# Altium schematic sheet Sheet-QBOOST-v0.2.SchDoc
size A1; Organization: Protel International P/L; Address1: L3, 12a Rodborough Rd; Address2: Frenchs Forest; Address3: NSW; Address4: Australia 2086
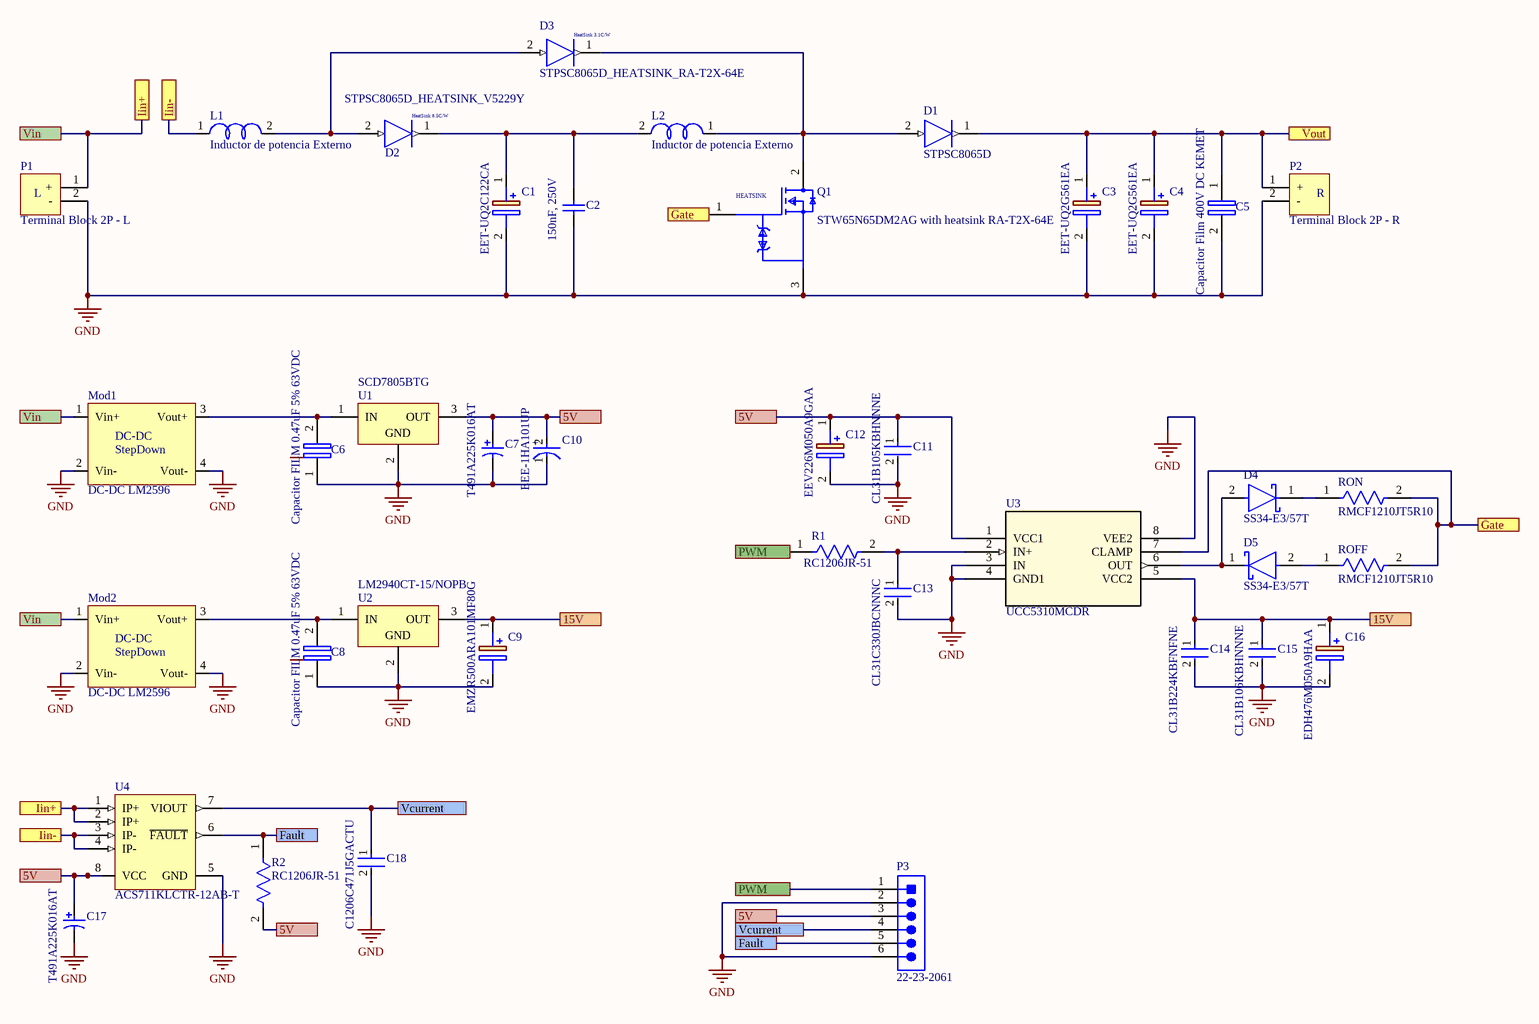
[diagram p0: Sheet-QBOOST-v0.2.SchDoc]

## Parts
C1  EET-UQ2C122CA  [CAPPRD1000W200D2550H3700]
C2  150nF, 250V  [WCAP-FTBP_L10.5W5H11]
C3  EET-UQ2G561EA  [CAPPRD1000W200D3550H3700]
C4  EET-UQ2G561EA  [CAPPRD1000W200D3550H3700]
C5  Capacitor Film 400V DC KEMET  [Cap Film 18x5]
C6  Capacitor FILM 0.47uF 5% 63VDC  [Capacitor 5mm Radial]
C7  T491A225K016AT  [KEMT-T491-A_N]
C8  Capacitor FILM 0.47uF 5% 63VDC  [Capacitor 5mm Radial]
C9  EMZR500ARA101MF80G  [CAP6.3X8]
C10  EEE-1HA101UP  [FP-SF-MFG]
C11  CL31B105KBHNNNE  [FP-CL31-IPC_B]
C12  EEV226M050A9GAA  [CAP6.3X5.65]
C13  CL31C330JBCNNNC  [FP-CL31-IPC_B]
C14  CL31B224KBFNFNE  [FP-CL31-IPC_B]
C15  CL31B106KBHNNNE  [FP-CL31-IPC_B]
C16  EDH476M050A9HAA  [CAP6.3X8]
C17  T491A225K016AT  [KEMT-T491-A_N]
C18  C1206C471J5GACTU  [FP-C1206C-EB-IPC_B]
D1  STPSC8065D  [TO505P460X1020X1968-2P]
D2  STPSC8065D_HEATSINK_V5229Y  [TO505P460X1020X1968-2P - HEATSINK - V5229Y]
D3  STPSC8065D_HEATSINK_RA-T2X-64E  [TO505P460X1020X1968-2P - HEATSINK - RA-T2X-64E]
D4  SS34-E3/57T  [FP-95402-MFG]
D5  SS34-E3/57T  [FP-95402-MFG]
L1  Inductor de potencia Externo  [KF7.62-P3]
L2  Inductor de potencia Externo  [KF7.62-P3]
Mod1  DC-DC LM2596  [Mod 21x43 mm]
Mod2  DC-DC LM2596  [Mod 21x43 mm]
P1  Terminal Block 2P - L  [KF7.62-P2 - TB - L]
P2  Terminal Block 2P - R  [KF7.62-P2 - TB - R]
P3  22-23-2061  [MOLX-22-23-2061_V]
Q1  STW65N65DM2AG with heatsink RA-T2X-64E  [FP-TO-247-0075325-MFG HEATSINK RA-T2X-64E]
R1  RC1206JR-51  [FP-RC1206-IPC_B]
R2  RC1206JR-51  [FP-RC1206-IPC_B]
ROFF  RMCF1210JT5R10  [FP-RC3225-IPC_B]
RON  RMCF1210JT5R10  [FP-RC3225-IPC_B]
U1  SCD7805BTG  [T0220-3]
U2  LM2940CT-15/NOPB  [T0220-3]
U3  UCC5310MCDR  [D8_TEX]
U4  ACS711KLCTR-12AB-T  [ALEG-LC-SOIC-8_V]

## Ports
5V, 15V, Fault, Gate, Iin+, Iin-, PWM, Vcurrent, Vin, Vout

## Nets
GND: C1.2(-) C2.1 C3.2(-) C4.2(-) C5.2 C6.1 C7.2 C8.1 C9.2(-) C10.1(C) C11.2 C12.2(-) C13.2 C14.2 C15.2 C16.2(-) C17.2 C18.2 Mod1.2(Vin-) Mod1.4(Vout-) Mod2.2(Vin-) Mod2.4(Vout-) P1.2(-) P2.2(-) P3.2 P3.6 Q1.3(S) U1.2(GND) U2.2(GND) U3.3(IN) U3.4(GND1) U3.8(VEE2) U4.5(GND)
5V: C7.1 C10.2(A) C11.1 C12.1(+) C17.1 P3.3 R2.2 U1.3(OUT) U3.1(VCC1) U4.8(VCC) ; port 5V
15V: C9.1(+) C14.1 C15.1 C16.1(+) U2.3(OUT) U3.5(VCC2) ; port 15V
Fault: P3.5 R2.1 U4.6(~{FAULT}) ; port Fault
Gate: Q1.1(G) ROFF.2 RON.2 U3.7(CLAMP) ; port Gate
Iin+: Mod1.1(Vin+) Mod2.1(Vin+) P1.1(+) U4.1(IP+) U4.2(IP+) ; port Iin+, port Vin
Iin-: L1.1 U4.3(IP-) U4.4(IP-) ; port Iin-
PWM: P3.1 R1.1 ; port PWM
Vcurrent: C18.1 P3.4 U4.7(VIOUT) ; port Vcurrent
Vout: C3.1(+) C4.1(+) C5.1 D1.1(K) P2.1(+) ; port Vout
NetC1_1: C1.1(+) C2.2 D2.1(K) L2.2
NetC6_2: C6.2 Mod1.3(Vout+) U1.1(IN)
NetC8_2: C8.2 Mod2.3(Vout+) U2.1(IN)
NetC13_1: C13.1 R1.2 U3.2(IN+)
NetD1_2: D1.2(A) D3.1(K) L2.1 Q1.2(D)
NetD2_2: D2.2(A) D3.2(A) L1.2
NetD4_1: D4.1(C) RON.1
NetD4_2: D4.2(A) D5.1(C) U3.6(OUT)
NetD5_2: D5.2(A) ROFF.1

## Notes on the sheet
- Title
- Size:
- Date:
- File:
- A1
- Number:
- Time:
- Revision:
- Sheet
- of
- (in symbol CMP-05427-000015-1) +
- (in symbol DC-DC LM2596) DC-DC; StepDown
- (in symbol MOSFET N STW65N65DM2AG_HEATSINK) HEATSINK
- (in symbol STPSC8065D_HEATSINK_RA-T2X-64E) HeatSink 3.1C/W
- (in symbol STPSC8065D_HEATSINK_V5229Y) HeatSink 8.5C/W
- (in symbol Terminal Block 2P - L) L
- (in symbol Terminal Block 2P - R) R

## Library data of the parts
C1 = EET-UQ2C122CA: Capacitor Polarised; Manufacturer_Name: Panasonic; Datasheet Link: https://media.digikey.com/pdf/Data%20Sheets/Panasonic%20Capacitors%20PDFs/TS-UQ_Series_2007.pdf; Height: 37mm; Manufacturer_Part_Number: EET-UQ2C122CA; Arrow Part Number: EET-UQ2C122CA
C2 = 890273322005CS: WCAP-FTBP Film Capacitor, THT, L10.5W5H11, 150nF, 250V; Manufacturer: Wurth Elektronik; Insulation Resistance: 30000MOhm; Dissipation Factor@1kHz: 0.1%; Dissipation Factor@100kHz: 0.26%; Rated Voltage: 250VDC; Rate of Voltage Rise: 340V/us; Pitch: 7.5mm; Technical Reference: MPPP075154J250DCPP45004; Capacitance Tolerance: +/-5%; ComponentLink1Description: Manufacturer; ComponentLink1URL: http://www.we-online.de; ComponentLink2Description: Datasheet; ComponentLink2URL: https://www.we-online.com/catalog/datasheet/890273322005CS.pdf; Length: 10.5mm; Mounting Technology: THT; Operating Temperature: -40 to +105degC; Manufacturer Part Number: 890273322005CS; Width: 5mm; Capacitance: 150nF; Dissipation Factor@10kHz: 0.1%; Height: 11mm; Packaging: Carton; Published Date: May 2020
C3 C4 = EET-UQ2G561EA: Capacitor Polarised; Manufacturer_Name: Panasonic; Datasheet Link: https://media.digikey.com/pdf/Data%20Sheets/Panasonic%20Capacitors%20PDFs/TS-UQ_Series_2007.pdf; Height: 37mm; Manufacturer_Part_Number: EET-UQ2G561EA; Arrow Part Number: EET-UQ2G561EA
C5 = Cap film 400V DC 0.1uF
C7 C17 = CMP-2000-07187-1: Tantalum Capacitor, 2.2 uF, +/- 10%, 16 V, -55 to 125 degC, 2-Pin SMD, RoHS, Tape and Reel; Manufacturer: Kemet; Capacitance: 2200000pF; Product Depth (mm): 1.6mm; DCL: 0.4uA; Wire Form: NotRequired; Case Style: Molded; ESR: 6ohm; Polarity: Polar; Product Length (mm): 3.2mm; Voltage: 16VDC; Lead Spacing (nom): NotRequiredmm; DF: 6%; Rad Hardened: No; Operating Temp Range: -55Cto125C; Datasheet Version: 10/2016; Packaging: TapeandReel; Mounting Style: SurfaceMount; Manufacturer URL: http://www.kemet.com/; Seal: NotRequired; Product Height (mm): 1.6mm; Construction: SMTChip; Length W/Weld: NotRequiredmm; Package Reference: T491-A; Package Description: 2-Pin Surface Mount Device, Body 3.2 x 1.6 mm; Tolerance (+ or -): 10%; Length W/Weld (max): NotRequiredmm; Insulation: NotRequired; Mounting Technology: SurfaceMount; Package / Case: 3216-18; Seated Plane Height: NotRequiredmm; Case Code: A; Datasheet URL: http://capacitoredge.kemet.com/capedge2/DataSheet/Datasheet-T491A225K016AT.pdf?pn=T491A225K016AT; Product Diameter (mm): NotRequiredmm; Failure Rate: NotRequired
C9 = EMZR500ARA101MF80G: CAP ALUM 100UF 20% 50V SMD; Manufacturer_Name: United Chemi-Con; Datasheet Link: http://www.chemi-con.co.jp/cgi-bin/CAT_DB/SEARCH/cat_db_al.cgi?e=e&j=p&pdfname=mzr; Height: 8.2mm; Manufacturer_Part_Number: EMZR500ARA101MF80G
C10 = CMP-05427-000015-1: CAP ALUM 100UF 20% 50V SMD; Manufacturer: Panasonic; Automotive Grade: Grade 3; Leakage Current: 100uA; Dissipation Factor: 0.12%; Life: 2000Hours; Ripple Current: 200mA; Material: Aluminum; ComponentLink2Description: Datasheet; Category: Cap; Voltage Rating: 50V; Value: 100uF; Octopart: https://octopart.com/eee-1ha101up-panasonic-55396734; Digikey Description: CAP ALUM 100UF 20% 50V SMD; Package: SF; RoHS: TRUE; Height: 10.5mm; ComponentLink2URL: https://industrial.panasonic.com/cdbs/www-data/pdf/RDE0000/ABA0000C1145.pdf; Tolerance: 20%; Mouser Description: Cap Aluminum Lytic 100uF 50V 20% (8 X 10.2mm) SMD 200mA 2000h 85C Automotive T/R; Device Class L2: Capacitors; Temperature Range High: +85°C; Lead Free: Yes; Device Class L3: Aluminum Electrolytic Capacitors; Device Class L1: Passive Components; Manufacturer Part Number: EEE-1HA101UP; Temperature: -40°C to +85°C; Automotive: Yes; Capacitance: 100uF; Voltage: 50V; Temperature Range Low: -40°C
C11 = CMP-13271-001662-1: Cap Ceramic 1uF 50V X7R ±10% SMD 1206 +125°C Embossed T/R; Case Code (Metric): 3216; Packaging: Tape and Reel; Depth: 1.6mm; Max Operating Temperature: 125°C; Length: 3.2mm; Contact Plating: Tin; Voltage Rating (DC): 50V; Radiation Hardening: No; Min Operating Temperature: -55°C; Dielectric: X7R; Voltage: 50V; Lead Free: Lead Free; Capacitance: 1uF; Package Quantity: 1; Material: Ceramic; Thickness: 0.071inch; Width: 0.063inch; Voltage Rating: 50V; Case Code (Imperial): 1206; Mount: Surface Mount; Case/Package: 1206; Tolerance: 10%; Height: 1.6mm
C12 = EEV226M050A9GAA: CAP ALUM SMD 105C 22UF 50VDC; Manufacturer_Name: KEMET; Datasheet Link: https://content.kemet.com/datasheets/KEM_A4002_EEV.pdf; Height: 5.65mm; Manufacturer_Part_Number: EEV226M050A9GAA
C13 = CMP-13271-000198-1: Cap Ceramic 33pF 50V C0G ±5% SMD 1206 +125°C Embossed T/R; Temperature Coefficient: 300ppm/°C; Case Code (Imperial): 1206; Mount: Surface Mount; Length: 3.2mm; Packaging: Tape and Reel; Dielectric: C0G; Material: Ceramic; Voltage Rating (DC): 50V; Tolerance: 5%; Lead Free: Lead Free; Max Operating Temperature: 125°C; Case/Package: 1206; Package Quantity: 1; Case Code (Metric): 3216; Min Operating Temperature: -55°C; Capacitance: 33pF; Width: 0.063inch; Height: 0.85mm; Radiation Hardening: No; Voltage Rating: 50V; Voltage: 50V; Depth: 1.6mm; Thickness: 0.039inch
C14 = CMP-13271-000776-1: Cap Ceramic 220nF 50V X7R ±10% SMD 1206 +125°C Embossed T/R; Length: 0.126inch; Case Code (Imperial): 1206; Package Quantity: 1; Case Code (Metric): 3216; Case/Package: 1206; Radiation Hardening: No; Min Operating Temperature: -55°C; Mount: Surface Mount; Max Operating Temperature: 125°C; Depth: 1.6mm; Tolerance: 10%; Capacitance: 220nF; Thickness: 0.055inch; Height: 1.25mm; Dielectric: X7R; Voltage Rating: 50V; Width: 0.063inch; Packaging: Tape and Reel
C15 = CMP-13271-000776-1: CAP CER 10UF 50V  X7R ±10% SMD 1206 +125°C Embossed T/R; Capacitance: 220nF; Length: 0.126inch; Case Code (Imperial): 1206; Package Quantity: 1; Case Code (Metric): 3216; Case/Package: 1206; Radiation Hardening: No; Min Operating Temperature: -55°C; Mount: Surface Mount; Max Operating Temperature: 125°C; Depth: 1.6mm; Tolerance: 10%; Thickness: 0.055inch; Height: 1.25mm; Dielectric: X7R; Voltage Rating: 50V; Width: 0.063inch; Packaging: Tape and Reel
C16 = EDH476M050A9HAA: CAP ALUM SMD 105C 47UF 50VDC; Manufacturer_Name: KEMET; Datasheet Link: https://content.kemet.com/datasheets/KEM_A4049_EDH.pdf; Height: 8mm; Manufacturer_Part_Number: EDH476M050A9HAA
C18 = CMP-03020-008367-1: 1206 C 470pF Ceramic Multilayer Capacitor; 50 V; +125degC; C0G Dielectric; +/-5%; Manufacturer: KEMET; Tolerance: 0.05; Temperature Coefficient: 15%; Voltage Rating: 50 V; Automotive Grade: Grade 0; Manufacturer Part Number: C1206C471J5GACTU; Value: 470 pF; Automotive: Yes; Temperature Range High: +150°C; ComponentLink2URL: https://content.kemet.com/datasheets/KEM_C1007_X8R_ULTRA_150C_SMD.pdf; Octopart: https://octopart.com/c1206c471j5gactu-kemet-123947; Package: C1206C-EB; Capacitance: 470 pF; Temperature Range Low: -55°C; Material: Ceramic; Device Class L1: Passive Components; Device Class L3: Ceramic Capacitors; Ipc Land Pattern Name: CAPC320160X78; Height: 0.88mm; Category: Cap; Lead Free: Yes; ComponentLink2Description: Datasheet; Temperature: -55°C to +150°C; Mouser Description: 1206 C 470pF Ceramic Multilayer Capacitor; 50 V; +125degC; C0G Dielectric; +/-5%; Device Class L2: Capacitors; RoHS: TRUE; Digikey Description: 1206 C 470pF Ceramic Multilayer Capacitor; 50 V; +125degC; C0G Dielectric; +/-5%; Temperature Characteristic: C0G
D1 = STPSC8065D: Diode; Manufacturer_Name: STMicroelectronics; Datasheet Link: http://www.mouser.com/datasheet/2/389/stpsc8065-1156476.pdf; Height: 4.6mm; Manufacturer_Part_Number: STPSC8065D; Arrow Part Number: STPSC8065D
D2 = STPSC8065D_HEATSINK_V5229Y: Diode with heatsink V5229Y; Manufacturer_Name: STMicroelectronics; Datasheet Link: http://www.mouser.com/datasheet/2/389/stpsc8065-1156476.pdf; Height: 4.6mm; Manufacturer_Part_Number: STPSC8065D; Arrow Part Number: STPSC8065D
D3 = STPSC8065D_HEATSINK_RA-T2X-64E: Diode with heatsink RA-T2X-64E; Manufacturer_Name: STMicroelectronics; Datasheet Link: http://www.mouser.com/datasheet/2/389/stpsc8065-1156476.pdf; Height: 4.6mm; Manufacturer_Part_Number: STPSC8065D; Arrow Part Number: STPSC8065D
D4 D5 = CMP-02539-000012-1: DIODE SCHOTTKY 40V 3A DO214AB; Manufacturer: Vishay; Max Junction Temp: +150°C; Peak Reverse Current: 0.5mA; Max Surge Forward Current: 100A; Standoff Height: 0mm; ComponentLink2Description: Datasheet; Device Class L3: Schottky Diodes; Height: 2.62mm; Max Repetitive Reverse Voltage: 40V; Lead Free: Yes; Package: 95402; Temperature Range High: +150°C; ComponentLink2URL: http://www.vishay.com/docs/88751/ss32.pdf; Temperature: -55°C to +150°C; Footprint Url: http://www.vishay.com/docs/95402/smc.pdf; Automotive: No; Forward Current: 3A; Category: Diode; Manufacturer Part Number: SS34-E3/57T; RoHS: TRUE; Device Class L2: Diodes; Mouser Description: Schottky Diodes & Rectifiers 3.0 Amp 40 Volt; Octopart: https://octopart.com/ss34-e3%2F57t-vishay-39552907; Temperature Range Low: -55°C; Device Class L1: Discrete Semiconductors; Digikey Description: DIODE SCHOTTKY 40V 3A DO214AB
L1 L2 = Inductor
Mod1 Mod2 = DC-DC LM2596: LM2596HV DC-DC Adjustable Step Down Buck Converter Power Module 4.5-50V To 3-35V Current limiting
P1 = Terminal Block 2P - L: Bornera con espaciado entre pines de 7.62mmSoporta hasta 20Amperios / Voltaje máximo de trabajo 300V / Calibre de cable ideal para acoplar 22 hasta 12 AWG / Cuenta con acoples laterales para aumentar los terminales
P2 = Terminal Block 2P - R: Bornera con espaciado entre pines de 7.62mmSoporta hasta 20Amperios / Voltaje máximo de trabajo 300V / Calibre de cable ideal para acoplar 22 hasta 12 AWG / Cuenta con acoples laterales para aumentar los terminales
P3 = CMP-2000-05536-1: Male Header, Pitch 2.54 mm, 1 x 6 Position, Height 10.67 mm, Tail Length 3.56 mm, 0 to 70 degC, RoHS, Bulk; Manufacturer: Molex; Pitch: 2.54mm; Mounting Angle: Vertical; Current Rating: 4A; Number of Positions / Contacts: 6; Voltage Rating: 250V; Packaging: Bulk; Package Description: Male Header, Pitch 2.54 mm, 1 x 6 Position, Height 10.67 mm, Tail Length 3.56 mm; Number of Rows: 1; Type: PinStrip; Contact Material: Brass; Product Category: .100K.K.Connectors; Factory Pack Quantity: 1000; Mounting Style: ThroughHole; RoHS: Details; Contact Plating: Tin; Housing Material: Nylon; Mounting Technology: ThroughHole; Termination Style: ThroughHole; Tradename: KK; Number of Positions: 6; Brand: Molex; Product Type: Headers; Series: 6373; Datasheet URL: https://datasheet.ciiva.com/19460/232303-19460895.pdf; Package Reference: 22-23-2061; Datasheet Version: Rev. P, 09/2001; Manufacturer URL: http://www.molex.com/
Q1 = MOSFET N STW65N65DM2AG_HEATSINK: MOSFET N-CH 650V 60A TO-247; Manufacturer: STMicroelectronics; Number Of Channels: 1; Gate To Source Voltage: 25V; Depletion Mode: False; Continuous Drain Current: 38A; Threshold Vgs Min: 3V; Threshold Vgs Max: 5V; Drain To Source Resistance: 0.05Ω; Input Capacitace At Vds: 5500pF @ 100V; Reverse Recovery Charge: 3.65uC; Reverse Recovery Time: 288ns; Max Junction Temp: +150°C; Gate Charge At Vgs: 27nC @ 10V; Pulse Drain Current: 240A; Max Forward Diode Voltage: 1.6V; Rthja Max: 50°C/W; Turn Off Delay Time: 65ns; Automotive Grade: Grade 0; Power Dissipation: 446W; Turn On Delay Time: 18ns; Standoff Height: 3.7mm; RoHS: TRUE; Device Class L3: MOSFETs; Temperature Range High: +150°C; Automotive: Yes; Height: 24.45mm; Category: Trans; Temperature Range Low: -55°C; Drain To Source Voltage: 650V; Ipc Land Pattern Name: TO-220; Digikey Description: MOSFET N-CH 650V 60A TO-247; Temperature: -55°C to +150°C; Device Class L1: Discrete Semiconductors; ComponentLink2URL: https://www.st.com/resource/en/datasheet/stw22n95k5.pdf; Number Of N Channels: 1; Manufacturer Part Number: STW65N65DM2AG; Device Class L2: Transistors; Package: TO-247-0075325; Drain To Source Breakdown Voltage: 650V; Lead Free: Yes; ComponentLink2Description: Datasheet
R1 R2 = CMP-03412-007570-1: RES SMD 51 OHM  1/4W 1206; Manufacturer Part Number: RC1206JR-070RL; Manufacturer: YAGEO; Voltage Rating: 200V; Temperature Coefficient: 300ppm/°C; Power Rating: 0.25W; Value: 0Ω; Tolerance: 5%; Temperature Range Low: -55°C; Category: Res; Automotive: No; Ipc Land Pattern Name: RESC310160X55; Device Class L1: Passive Components; Temperature: -55°C to +155°C; ComponentLink2URL: https://www.yageo.com/upload/media/product/productsearch/datasheet/rchip/PYu-RC_Group_51_RoHS_L_10.pdf; Lead Free: Yes; Height: 0.65mm; Footprint Url: https://www.yageo.com/upload/website/yageo_PYu-R_Mount_10_19050818_343.pdf; Package: RC1206; Digikey Description: RES SMD 0 OHM JUMPER 1/4W 1206; Temperature Range High: +155°C; Device Class L3: Chip SMD Resistors; Device Class L2: Resistors; Octopart: https://octopart.com/rc1206jr-070rl-yageo-40025601; Resistance: 0Ω; Series: RC; ComponentLink2Description: Datasheet; Composition: Thick Film; RoHS: TRUE; Mouser Description: Resistor: thick film; SMD; 1206; 0O; 0.25W; ±5%; -55÷155°C
ROFF RON = CMP-13261-001722-1: RES 5.1 OHM 5% 1/2W 1210; Voltage Rating (DC): 200V; Resistance: 51R; Max Power Dissipation: 333mW; Temperature Coefficient: 100ppm/°C; Features: Moisture Resistant; Min Operating Temperature: -55°C; Composition: Thick Film; Case Code (Imperial): 1210; Contact Plating: Tin; Height: 0.026inch; Number of Terminations: 2; Case/Package: 1210; Max Operating Temperature: 155°C; Width: 0.1inch; Packaging: Tape and Reel; Length: 0.126inch; Tolerance: 5%; Case Code (Metric): 3225; Radiation Hardening: No; Lead Free: Lead Free
U1 = SCD7805BTGOS-ND: IC VOLT REG 1A 5V TO220 3-pin; Manufacturer: On Semiconductor; CompType: LDO IC; PackageTopMarking: NSUZXYTTE#*LM2940CT*-15 P+; PowerWise: N; PackageDescription: TO-220, Molded, 3 Lead, Straight; RoHS: Y; PackageReference: CASE 221AB−01; ComponentLink1Description: Datasheet URL; PinCount: 3; ComponentLink1URL: http://www.ti.com/general/docs/lit/getliterature.tsp?genericPartNumber=LM2940C&fileType=pdf
U2 = CMP-0062-02546-3: 1A Low Dropout Regulator, 3-pin TO-220, Pb-Free; Manufacturer: Texas Instruments; CompType: LDO IC; PackageTopMarking: NSUZXYTTE#*LM2940CT*-15 P+; PowerWise: N; PackageDescription: TO-220, Molded, 3 Lead, Straight; RoHS: Y; PackageReference: NDE0003A; ComponentLink1Description: Datasheet URL; PinCount: 3; ComponentLink1URL: http://www.ti.com/general/docs/lit/getliterature.tsp?genericPartNumber=LM2940C&fileType=pdf
U3 = UCC5310MCDR: No Description Available; Vendor: Texas Instruments; Built_By: EMA_Molly; SourceLibrary: TI_2020-05-18; Manufacturer_Part_Number: UCC5310MCDR; Copyright: Copyright (C) 2018 Accelerated Designs. All rights reserved; RefDes: RefDes; Type: DEV
U4 = ACS711KLCTR-12AB-T: Hall Effect Linear Current Sensor with Overcurrent Fault Output for <100 V Isolation Applications, 3 to 5.5 V, -12.5 to 12.5 A IP, -40 to 125 degC, 8-Pin SOIC (LC), RoHS, Tape and Reel; -3dB Bandwidth: 0.1 MHz; VCC Max: 5.5 V; IP Max: 12.5 A; VCC Min: 3 V; IP Min: -12.5 A; RoHS: TRUE; ComponentLink2Description: Datasheet; PartNumber: ACS711KLCTR-12AB-T; Temperature Min: -40 degC; ComponentLink3URL: http://www.allegromicro.com/~/media/Files/Datasheets/ACS711-Datasheet.ashx?la=en; Packing: Tape and Reel; ComponentLink1Description: Manufacturer URL; PackageDescription: 8-Pin Small Outline Integrated Package, Body 4.9 x 3.9 mm, Pitch 1.27 mm; ComponentLink1URL: http://www.allegromicro.com/; ComponentLink3Description: Package Specification; ComponentLink2URL: http://www.allegromicro.com/~/media/Files/Datasheets/ACS711-Datasheet.ashx?la=en; Temperature Max: 125 degC; DatasheetVersion: Rev. 3; Mounting Technology: Surface Mount